# Altium schematic sheet SoC_MMC.SchDoc
size A4; SheetNumber: 19; SheetTotal: 22
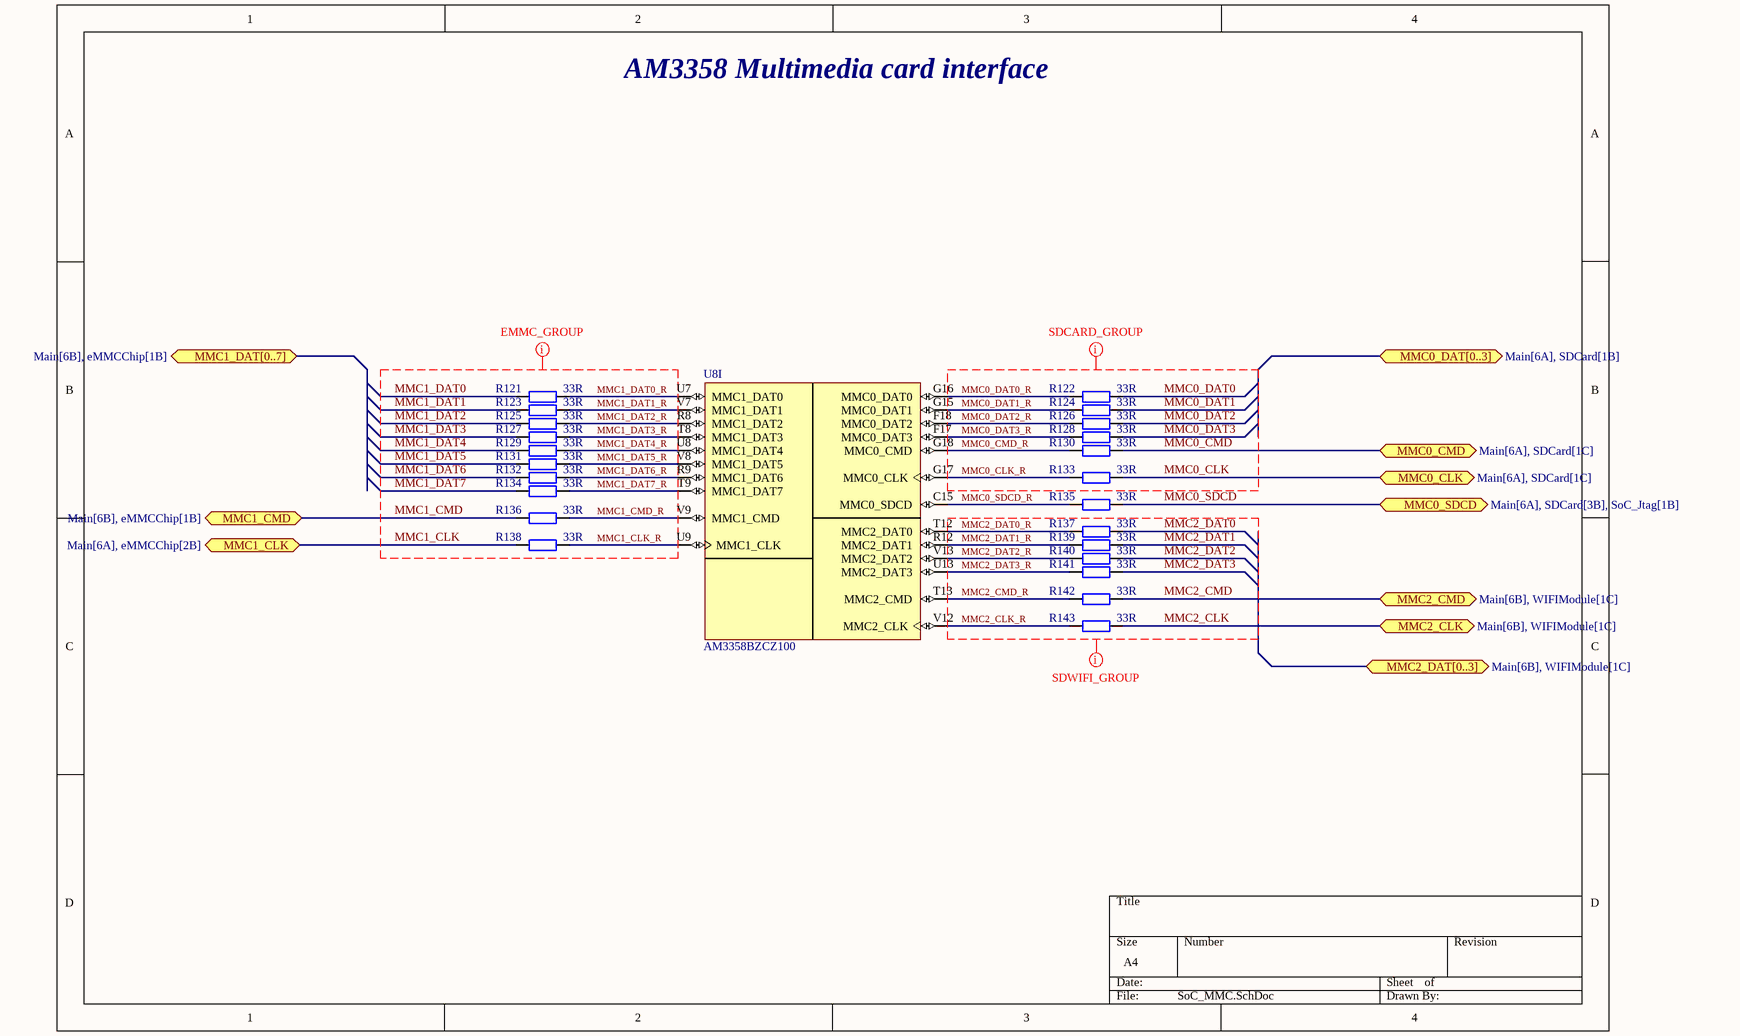
[diagram p0: SoC_MMC.SchDoc]

## Parts
R121  33R  [R_0402]
R122  33R  [R_0402]
R123  33R  [R_0402]
R124  33R  [R_0402]
R125  33R  [R_0402]
R126  33R  [R_0402]
R127  33R  [R_0402]
R128  33R  [R_0402]
R129  33R  [R_0402]
R130  33R  [R_0402]
R131  33R  [R_0402]
R132  33R  [R_0402]
R133  33R  [R_0402]
R134  33R  [R_0402]
R135  33R  [R_0402]
R136  33R  [R_0402]
R137  33R  [R_0402]
R138  33R  [R_0402]
R139  33R  [R_0402]
R140  33R  [R_0402]
R141  33R  [R_0402]
R142  33R  [R_0402]
R143  33R  [R_0402]
U8  AM3358BZCZ100  [BGA324C80P18X18_1500X1500X140]  (part I of 9)

## Ports
MMC0_CLK (bidir, see Main[6A], SDCard[1C]), MMC0_CMD (bidir, see Main[6A], SDCard[1C]), MMC0_DAT[0..3] (bidir, see Main[6A], SDCard[1B]), MMC0_SDCD (bidir, see Main[6A], SDCard[3B], SoC_Jtag[1B]), MMC1_CLK (bidir, see Main[6A], eMMCChip[2B]), MMC1_CMD (bidir, see Main[6B], eMMCChip[1B]), MMC1_DAT[0..7] (bidir, see Main[6B], eMMCChip[1B]), MMC2_CLK (bidir, see Main[6B], WIFIModule[1C]), MMC2_CMD (bidir, see Main[6B], WIFIModule[1C]), MMC2_DAT[0..3] (bidir, see Main[6B], WIFIModule[1C])

## Nets
MMC0_CLK: R133.2 ; port MMC0_CLK
MMC0_CLK_R: R133.1 U8.G17(MMC0_CLK)
MMC0_CMD: R130.2 ; port MMC0_CMD
MMC0_CMD_R: R130.1 U8.G18(MMC0_CMD)
MMC0_DAT0: R122.2
MMC0_DAT0_R: R122.1 U8.G16(MMC0_DAT0)
MMC0_DAT1: R124.2
MMC0_DAT1_R: R124.1 U8.G15(MMC0_DAT1)
MMC0_DAT2: R126.2
MMC0_DAT2_R: R126.1 U8.F18(MMC0_DAT2)
MMC0_DAT3: R128.2
MMC0_DAT3_R: R128.1 U8.F17(MMC0_DAT3)
MMC0_SDCD: R135.2 ; port MMC0_SDCD
MMC0_SDCD_R: R135.1 U8.C15(MMC0_SDCD)
MMC1_CLK: R138.1 ; port MMC1_CLK
MMC1_CLK_R: R138.2 U8.U9(MMC1_CLK)
MMC1_CMD: R136.1 ; port MMC1_CMD
MMC1_CMD_R: R136.2 U8.V9(MMC1_CMD)
MMC1_DAT0: R121.1
MMC1_DAT0_R: R121.2 U8.U7(MMC1_DAT0)
MMC1_DAT1: R123.1
MMC1_DAT1_R: R123.2 U8.V7(MMC1_DAT1)
MMC1_DAT2: R125.1
MMC1_DAT2_R: R125.2 U8.R8(MMC1_DAT2)
MMC1_DAT3: R127.1
MMC1_DAT3_R: R127.2 U8.T8(MMC1_DAT3)
MMC1_DAT4: R129.1
MMC1_DAT4_R: R129.2 U8.U8(MMC1_DAT4)
MMC1_DAT5: R131.1
MMC1_DAT5_R: R131.2 U8.V8(MMC1_DAT5)
MMC1_DAT6: R132.1
MMC1_DAT6_R: R132.2 U8.R9(MMC1_DAT6)
MMC1_DAT7: R134.1
MMC1_DAT7_R: R134.2 U8.T9(MMC1_DAT7)
MMC2_CLK: R143.2 ; port MMC2_CLK
MMC2_CLK_R: R143.1 U8.V12(MMC2_CLK)
MMC2_CMD: R142.2 ; port MMC2_CMD
MMC2_CMD_R: R142.1 U8.T13(MMC2_CMD)
MMC2_DAT0: R137.2
MMC2_DAT0_R: R137.1 U8.T12(MMC2_DAT0)
MMC2_DAT1: R139.2
MMC2_DAT1_R: R139.1 U8.R12(MMC2_DAT1)
MMC2_DAT2: R140.2
MMC2_DAT2_R: R140.1 U8.V13(MMC2_DAT2)
MMC2_DAT3: R141.2
MMC2_DAT3_R: R141.1 U8.U13(MMC2_DAT3)

## Layout directives
net class EMMC_GROUP: MMC1_CLK, MMC1_CLK_R, MMC1_CMD, MMC1_CMD_R, MMC1_DAT0, MMC1_DAT0_R, MMC1_DAT1, MMC1_DAT1_R, MMC1_DAT2, MMC1_DAT2_R, MMC1_DAT3, MMC1_DAT3_R, MMC1_DAT4, MMC1_DAT4_R, MMC1_DAT5, MMC1_DAT5_R, MMC1_DAT6, MMC1_DAT6_R, MMC1_DAT7, MMC1_DAT7_R
net class SDCARD_GROUP: MMC0_CLK, MMC0_CLK_R, MMC0_CMD, MMC0_CMD_R, MMC0_DAT0, MMC0_DAT0_R, MMC0_DAT1, MMC0_DAT1_R, MMC0_DAT2, MMC0_DAT2_R, MMC0_DAT3, MMC0_DAT3_R
net class SDWIFI_GROUP: MMC2_CLK, MMC2_CLK_R, MMC2_CMD, MMC2_CMD_R, MMC2_DAT0, MMC2_DAT0_R, MMC2_DAT1, MMC2_DAT1_R, MMC2_DAT2, MMC2_DAT2_R, MMC2_DAT3, MMC2_DAT3_R

## Notes on the sheet
- AM3358 Multimedia card interface

## Library data of the parts
R121-R143 = R_0402: Resistor 0402 SMD
U8 = AM3358BZCZ100: ARM-ASeries 1GHz NFBGA-324 Microcontrollers (MCU/MPU/SOC) ROHS; Manufacturer: Texas Instruments; Manufacturer Part Number: AM3358BZCZ100; Datasheet Link: https://www.ti.com/lit/ds/symlink/am3358.pdf